# EAGLE design main_low_pass (EAGLE 6.4)
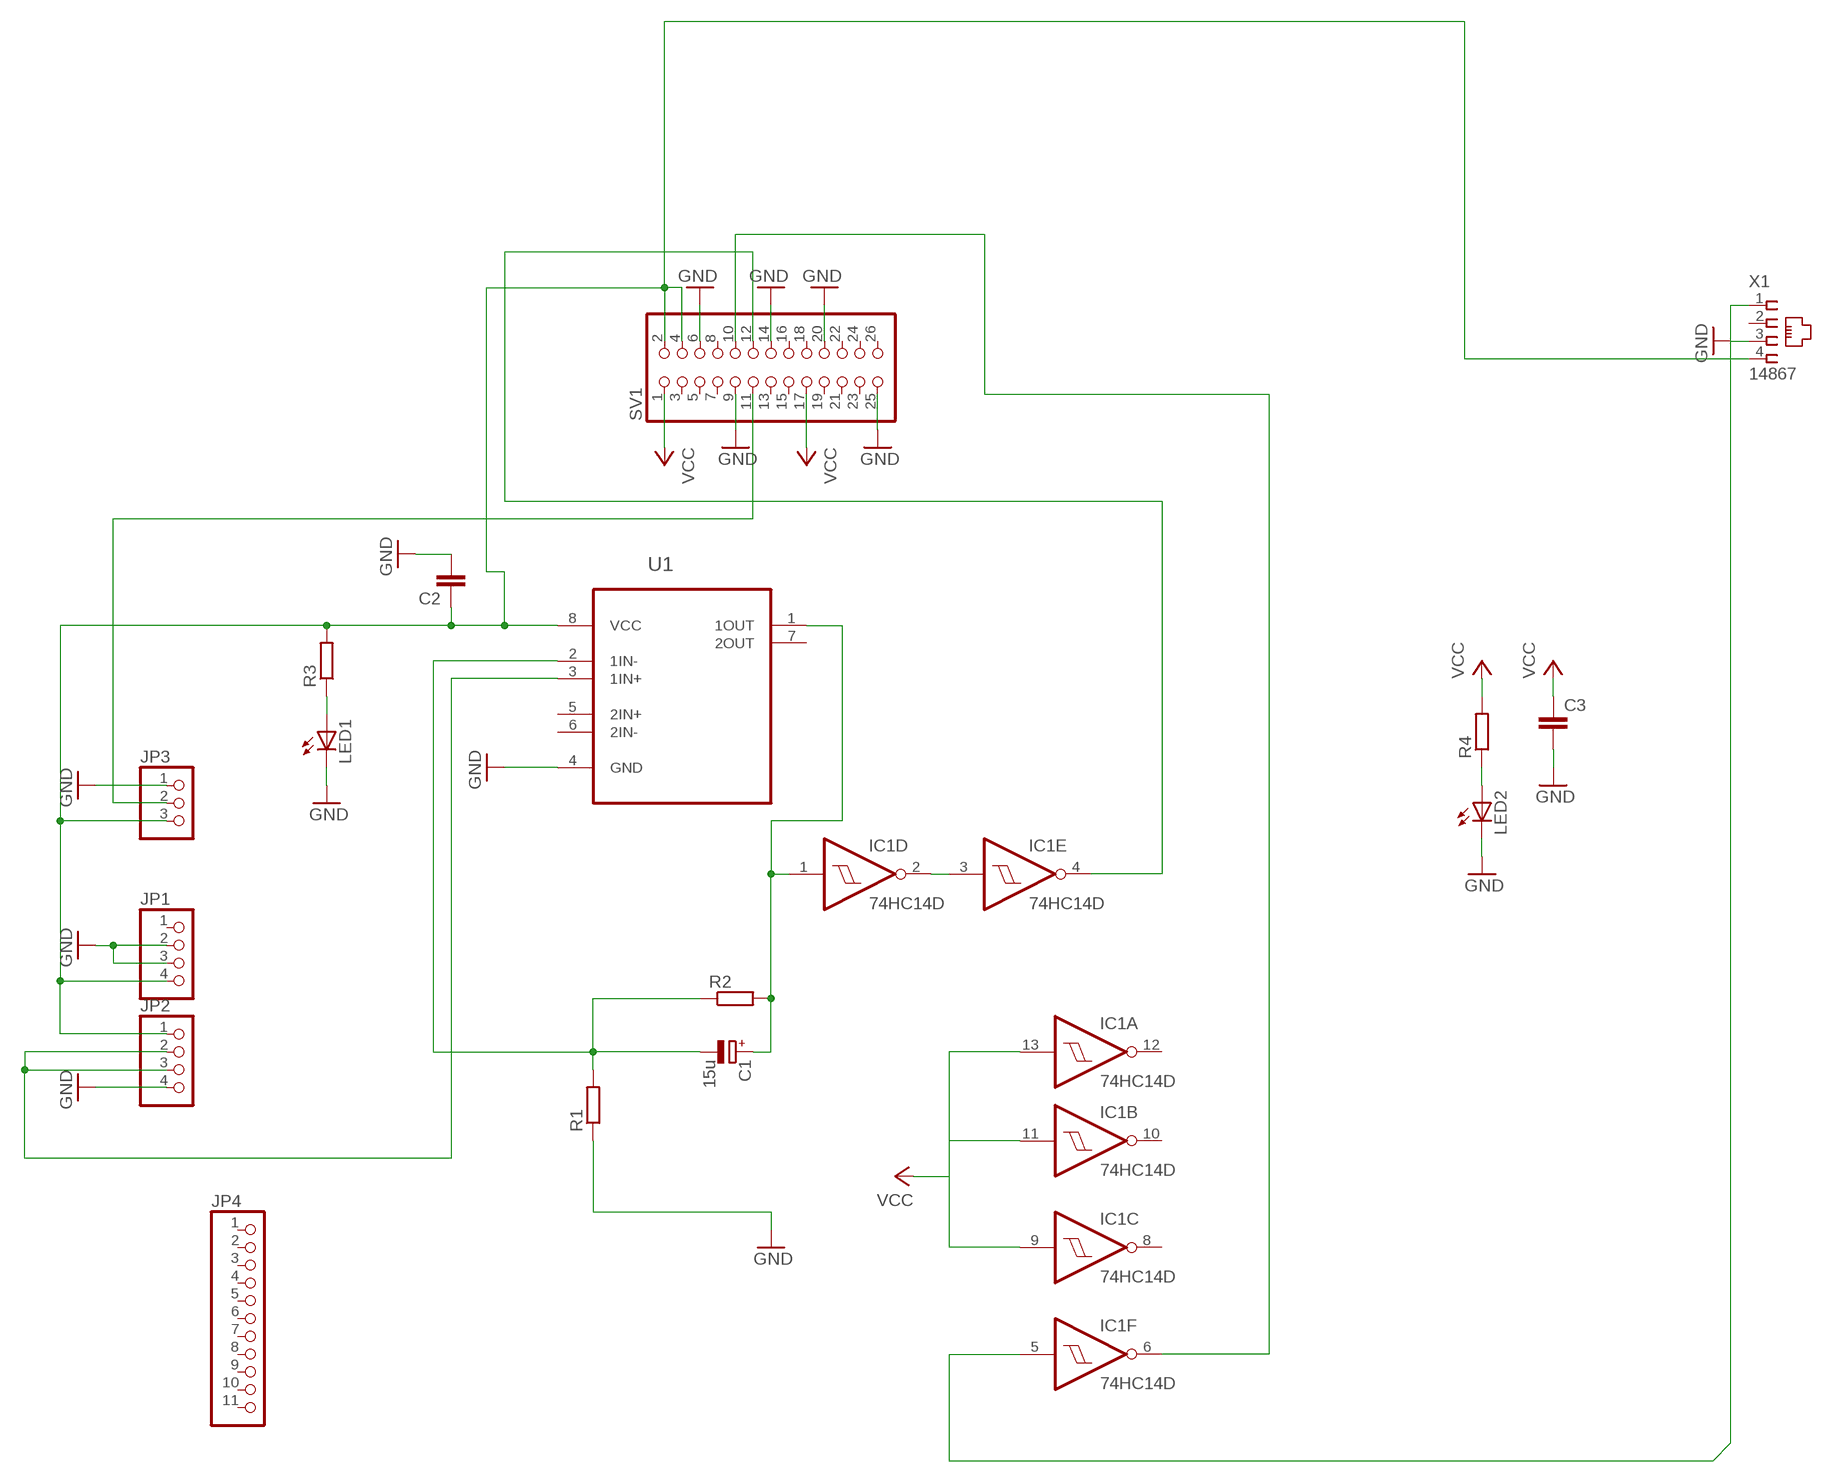
[diagram p0: schematic, sheet 1]

## Parts
C1  15u  CPOL-EU153CLV-0605  [153CLV-0605]
C2  C-EUC0805  [C0805]
C3  C-EUC0805  [C0805]
IC1  74HC14D  [SO14]
JP1  PINHD-1X4  [1X04]
JP2  PINHD-1X4  [1X04]
JP3  PINHD-1X3  [1X03]
JP4  PINHD-1X11  [1X11]
LED1  LEDCHIP-LED0805  [CHIP-LED0805]
LED2  LEDCHIP-LED0805  [CHIP-LED0805]
R1  R-EU_R0805  [R0805]
R2  R-EU_R0805  [R0805]
R3  R-EU_R0805  [R0805]
R4  R-EU_R0805  [R0805]
SV1  PINHD-2X13  [2X13]
U1  LM358PW  [SOP65P640X120-8N]
X1  14867  [14867]

## Nets
GND: C2.2 C3.2 JP1.2 JP1.3 JP2.4 JP3.1 LED1.C LED2.C R1.1 SV1.6 SV1.9 SV1.14 SV1.20 SV1.25 U1.4(GND) X1.3
N$1: JP2.2 JP2.3 U1.3(1IN+)
N$2: C1.- R1.2 R2.1 U1.2(1IN-)
N$3: IC1.2(D:O) IC1.3(E:I)
N$4: IC1.5(F:I) X1.1
N$5: JP3.2 SV1.11
N$6: C2.1 JP1.4 JP2.1 JP3.3 R3.2 SV1.2 SV1.4 U1.8(VCC) X1.4
N$7: C1.+ IC1.1(D:I) R2.2 U1.1(1OUT)
N$8: LED1.A R3.1
N$9: LED2.A R4.1
N$10: IC1.4(E:O) SV1.12
N$11: IC1.6(F:O) SV1.10
VCC: C3.1 IC1.9(C:I) IC1.11(B:I) IC1.13(A:I) R4.2 SV1.1 SV1.17
Unconnected: IC1.8(C:O) IC1.10(B:O) IC1.12(A:O) JP1.1 JP4.1 JP4.2 JP4.3 JP4.4 JP4.5 JP4.6 JP4.7 JP4.8 JP4.9 JP4.10 JP4.11 SV1.3 SV1.5 SV1.7 SV1.8 SV1.13 SV1.15 SV1.16 SV1.18 SV1.19 SV1.21 SV1.22 SV1.23 SV1.24 SV1.26 U1.5(2IN+) U1.6(2IN-) U1.7(2OUT) X1.2

## Power pins joined to a net without a drawn wire
GND: IC1.7(P:GND)
VCC: IC1.14(P:VCC)

## Library data of the parts
C1 = resistor:CPOL-EU: POLARIZED CAPACITOR, European symbol
C2 C3 = resistor:C-EU: CAPACITOR, European symbol
IC1 = 74xx-eu:74*14: Hex schmitt trigger INVERTER
JP1 JP2 = pinhead:PINHD-1X4: PIN HEADER
JP3 = pinhead:PINHD-1X3: PIN HEADER
JP4 = pinhead:PINHD-1X11: PIN HEADER
LED1 LED2 = led:LED: LED OSRAM: - CHIPLED LG R971, LG N971, LY N971, LG Q971, LY Q971, LO R971, LY R971 LH N974, LH R974 LS Q976, LO Q976, LY Q976 LO Q996 - Hyper CHIPLED LW Q18S LB Q993, LB Q99A, LB R99A - SideLED LS A670, LO A670, LY A670, LG A670, LP A670 LB A673, LV A673, LT A673, LW A673 LH A674 LY A675 LS A676, LA A676, LO A676, LY A676, LW A676 LS A679, LY A679, LG A679 - Hyper Micro SIDELED® LS Y876, LA Y876, LO Y876, LY Y876 LT Y87S - SmartLED LW L88C, LW L88S LB L89C, LB L89S, LG L890 LS L89K, LO L89K, LY L89K LS L896, LA L896, LO L896, LY L896 - TOPLED LS T670, LO T670, LY T670, LG T670, LP T670 LSG T670, LSP T670, LSY T670, LOP T670, LYG T670 LG T671, LOG T671, LSG T671 LB T673, LV T673, LT T673, LW T673 LH T674 LS T676, LA T676, LO T676, LY T676, LB T676, LH T676, LSB T676, LW T676 LB T67C, LV T67C, LT T67C, LS T67K, LO T67K, LY T67K, LW E67C LS E67B, LA E67B, LO E67B, LY E67B, LB E67C, LV E67C, LT E67C LW T67C LS T679, LY T679, LG T679 LS T770, LO T770, LY T770, LG T770, LP T770 LB T773, LV T773, LT T773, LW T773 LH T774 LS E675, LA E675, LY E675, LS T675 LS T776, LA T776, LO T776, LY T776, LB T776 LHGB T686 LT T68C, LB T68C - Hyper Mini TOPLED® LB M676 - Mini TOPLED Santana® LG M470 LS M47K, LO M47K, LY M47K Source: http://www.osram.convergy.de LUXEON: - LUMILED® LXK2-PW12-R00, LXK2-PW12-S00, LXK2-PW14-U00, LXK2-PW14-V00 LXK2-PM12-R00, LXK2-PM12-S00, LXK2-PM14-U00 LXK2-PE12-Q00, LXK2-PE12-R00, LXK2-PE12-S00, LXK2-PE14-T00, LXK2-PE14-U00 LXK2-PB12-K00, LXK2-PB12-L00, LXK2-PB12-M00, LXK2-PB14-N00, LXK2-PB14-P00, LXK2-PB14-Q00 LXK2-PR12-L00, LXK2-PR12-M00, LXK2-PR14-Q00, LXK2-PR14-R00 LXK2-PD12-Q00, LXK2-PD12-R00, LXK2-PD12-S00 LXK2-PH12-R00, LXK2-PH12-S00 LXK2-PL12-P00, LXK2-PL12-Q00, LXK2-PL12-R00 Source: www.luxeon.com KINGBRIGHT: KA-3528ASYC Source: www.kingbright.com
R1-R4 = resistor:R-EU_: RESISTOR, European symbol
SV1 = pinhead:PINHD-2X13: PIN HEADER
U1 = untitled:LM358PW: DUAL OPERATIONAL AMPLIFIERS; MPN: LM358PW; OC_FARNELL: 8389250; OC_NEWARK: 38K3721; PACKAGE: TSSOP-8; SUPPLIER: Texas Instruments
X1 = con-4ucon:14867: RJ11 Connector Source: 4UCON TECHNOLOGY INC. 14867.pdf; OC_FARNELL: unknown; OC_NEWARK: unknown

## Board
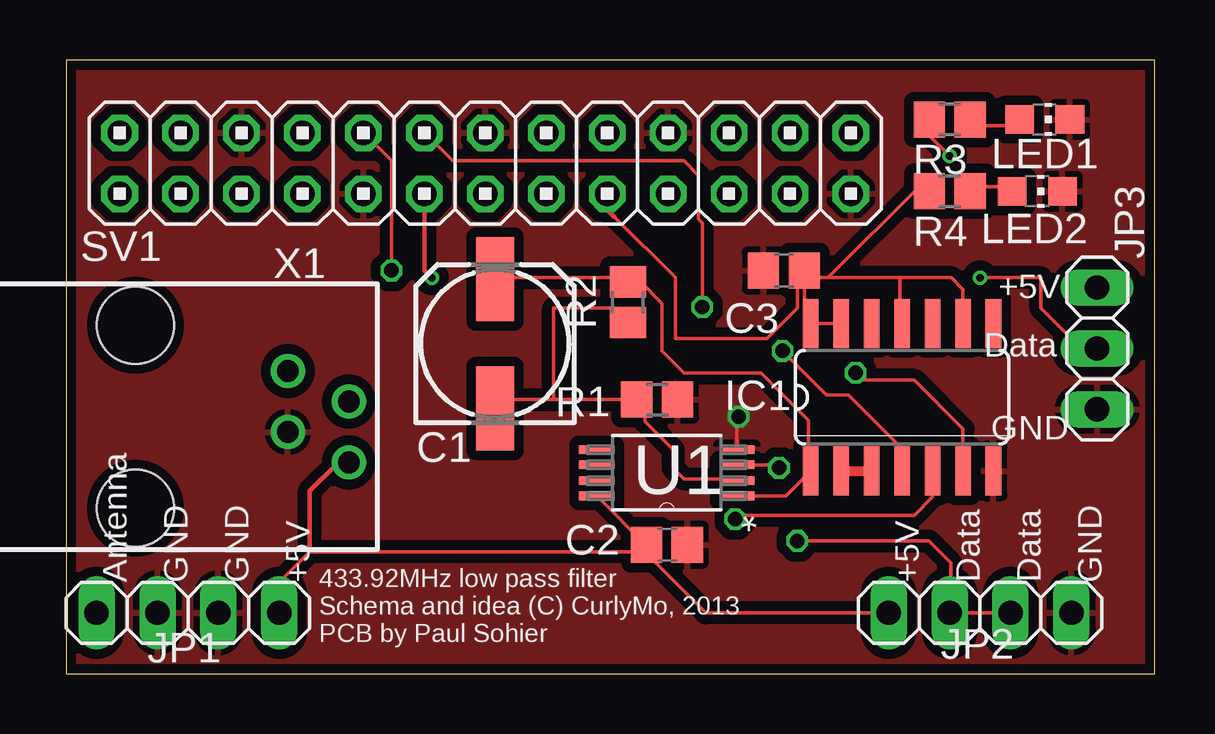
[diagram p1: board, top side]
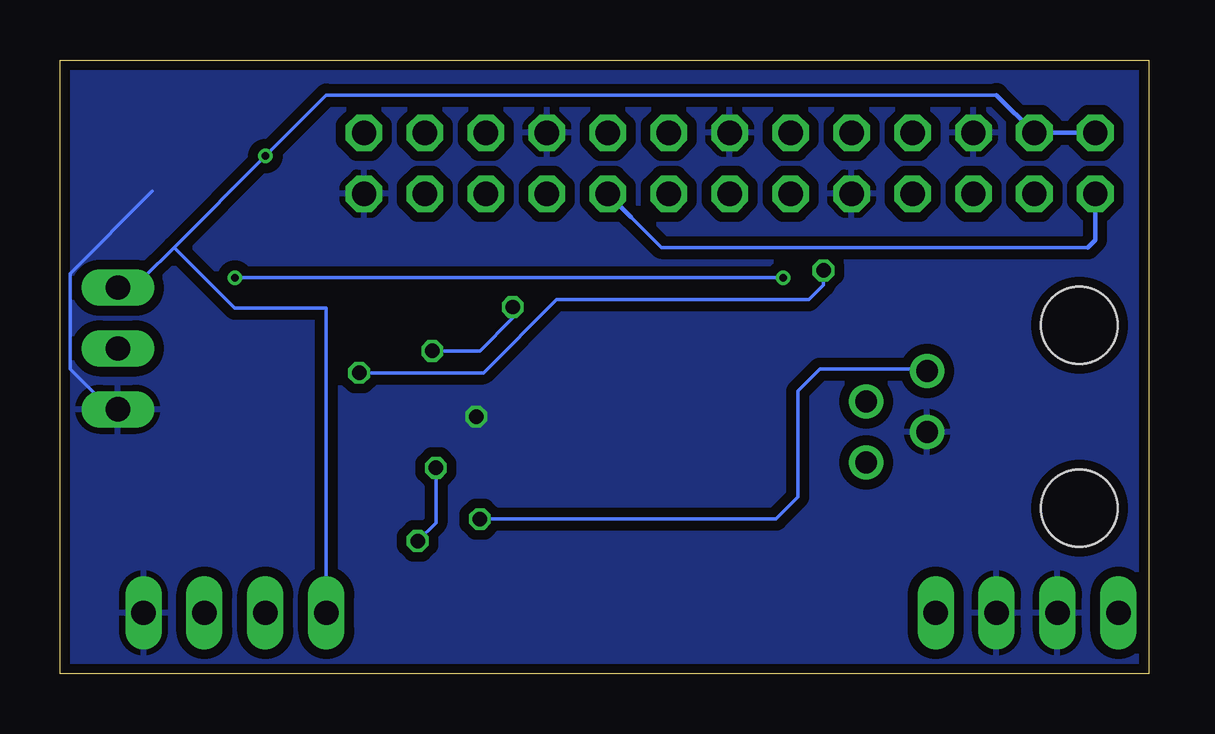
[diagram p2: board, bottom side, seen from below]

Size 45.39 x 25.59 mm. Coordinates in mm from the lower left corner, seen from the top.
Outline: 0,0 45.39,0 45.39,25.59 0,25.59 0,0
Copper layers (1*16): Top 0.035mm / dielectric 1.5mm / Bottom 0.035mm
Design rules "ITEADstudio_DRC": minimum track width 6mil, minimum drill 12mil, track to track 6mil, track to pad 6mil, pad to pad 6mil, via to via 6mil, smd to smd 0mil, copper to edge 10mil, drill to drill 10mil, minimum pad ring 10mil, minimum via ring 6mil, stop-mask expansion 2mil, vias tented up to drill 100mil, thermal gap 10mil

### Footprints (pad centres in the part's own frame; a part is rotated, then mirrored left to right if it is on the bottom)
153CLV-0605 = smd 3.5 x 1.6: + 2.7,0; - -2.7,0
C0805 = smd 1.3 x 1.5: 1 -0.85,0; 2 0.85,0
SO14 = smd 0.66 x 2.032: 1 -3.81,-3.073; 2 -2.54,-3.073; 3 -1.27,-3.073; 4 0,-3.073; 5 1.27,-3.073; 6 2.54,-3.073; 7 3.81,-3.073; 8 3.81,3.073; 9 2.54,3.073; 10 1.27,3.073; 11 0,3.073; 12 -1.27,3.073; 13 -2.54,3.073; 14 -3.81,3.073
1X04 = drill 1.016 long: 1 -3.81,0; 2 -1.27,0; 3 1.27,0; 4 3.81,0
1X03 = drill 1.016 long: 1 -2.54,0; 2 0,0; 3 2.54,0
CHIP-LED0805 = smd 1.2 x 1.2: A 0,-1.05; C 0,1.05
R0805 = smd 1.3 x 1.5: 1 -0.85,0; 2 0.85,0
2X13 = drill 1.016 octagon: 1 -15.24,-1.27; 2 -15.24,1.27; 3 -12.7,-1.27; 4 -12.7,1.27; 5 -10.16,-1.27; 6 -10.16,1.27; 7 -7.62,-1.27; 8 -7.62,1.27; 9 -5.08,-1.27; 10 -5.08,1.27; 11 -2.54,-1.27; 12 -2.54,1.27; 13 0,-1.27; 14 0,1.27; 15 2.54,-1.27; 16 2.54,1.27; 17 5.08,-1.27; 18 5.08,1.27; 19 7.62,-1.27; 20 7.62,1.27; 21 10.16,-1.27; 22 10.16,1.27; 23 12.7,-1.27; 24 12.7,1.27; 25 15.24,-1.27; 26 15.24,1.27
SOP65P640X120-8N = smd 1.473 x 0.356: 1 -2.921,0.965; 2 -2.921,0.33; 3 -2.921,-0.33; 4 -2.921,-0.965; 5 2.921,-0.965; 6 2.921,-0.33; 7 2.921,0.33; 8 2.921,0.965
14867 = drill 0.9 pad 1.422: 1 -1.905,6.35; 2 -0.635,8.89; 3 0.635,6.35; 4 1.905,8.89 | hole 3.2: -3.81,0; 3.81,0

### Placement (x,y rotation side)
C1  17.88,13.77 90 top
C2  25.04,5.38 0 top
C3  29.92,16.81 180 top
IC1  34.85,11.53 0 top
JP1  5.08,2.54 0 top
JP2  38.1,2.54 0 top
JP3  42.98,13.56 90 top
LED1  40.79,23.11 270 top
LED2  40.49,20.12 270 top
R1  24.64,11.43 180 top
R2  23.42,15.49 90 top
R3  36.83,23.11 180 top
R4  36.83,20.12 180 top
SV1  17.48,21.29 0 top
U1  25.04,8.38 180 top
X1  2.9,10.72 270 top

### Tracks (layer width: path | path; a pad name or v marks a point on that pad's centre or on a via)
GND  (via drill 0.6)
  Top 0.152: U1.4 27.96,10.64 v28.04,10.72
  Bottom 0.152: v28.04,10.72 28.04,10.87 27.89,11.02 | JP3.1 43.28,11.02 44.96,12.7 44.96,16.7 LED2.C
  pour Bottom (isolate 0.406): -0.15,25.45 0,0 45.52,0 45.36,25.6
  pour Top (isolate 0.406): 0,0 -0.3,25.45 45.42,25.6 45.72,0
N$1  (via drill 0.6)
  Top 0.152: JP2.3 JP2.2 36.88,2.59 36.88,4.62 35.97,5.54 v30.48,5.54 | U1.3 29.59,8.71 v29.72,8.59
  Bottom 0.152: v29.72,8.59 29.72,6.3 v30.48,5.54
N$2
  Top 0.152: 20.32,11.43 17.78,11.43 C1.- | 20.32,11.43 R1.2 24.13,11.43 24.13,10.52 25.3,9.35 25.3,8.59 25.76,8.13 27.89,8.13 U1.2 | 20.32,11.43 20.32,15.24 22.86,15.24 R2.1
N$3
  Top 0.406: IC1.2 IC1.3
N$4  (via drill 0.6)
  Top 0.152: IC1.5 36.12,7.37 35.36,6.6 28.04,6.6 v27.89,6.45
  Bottom 0.152: v27.89,6.45 15.54,6.45 14.63,7.37 14.63,11.79 13.72,12.7 9.32,12.7 X1.1
N$5  (via drill 0.3)
  Top 0.152: v38.1,16.51 40.64,16.51 40.64,15.24 41.91,13.97 JP3.2
  Top 0.178: v15.24,16.51 14.94,16.82 SV1.11
  Bottom 0.152: v38.1,16.51 v15.24,16.51
N$6  (via drill 0.3)
  Top 0.152: JP1.4 8.89,3.81 10.16,5.08 24.13,5.08 | 24.13,5.08 26.67,2.54 JP2.1 | 24.13,5.08 C2.1 24.16,5.38 U1.8 | v36.83,21.59 35.56,22.86 R3.2
  Top 0.178: 10.16,5.08 10.16,7.62 11.35,8.81 X1.4
  Bottom 0.152: 40.64,17.78 41.91,16.51 JP3.3 | 40.64,17.78 v36.83,21.59 34.29,24.13 6.35,24.13 | JP2.1 34.29,15.24 38.1,15.24 40.64,17.78
  Bottom 0.178: 6.35,24.13 SV1.4 SV1.2
N$7
  Top 0.152: C1.+ 17.78,16.51 22.86,16.51 R2.2 23.94,16.34 24.84,15.44 24.84,13.46 25.76,12.55 28.96,12.55 30.94,10.57 30.94,8.56 IC1.1 30,7.42 U1.1
N$8
  Top 0.152: LED1.A 39.37,22.86 38.1,22.86 R3.1
N$9
  Top 0.152: LED2.A 39.37,20.32 38.1,20.32 R4.1
N$10  (via drill 0.6)
  Top 0.152: IC1.4 34.85,9.4 32.61,11.63 31.7,11.63 v29.87,13.46 | v26.52,15.29 26.52,18.8 26.36,18.95 26.36,20.78 25.76,21.39 16.1,21.39 SV1.12
  Bottom 0.152: v29.87,13.46 27.89,13.46 26.52,14.83 v26.52,15.29
N$11  (via drill 0.6)
  Top 0.152: IC1.6 37.39,10.21 35.36,12.24 33.22,12.24 v32.92,12.55 | v13.56,16.82 13.56,21.39 SV1.10
  Bottom 0.152: v32.92,12.55 27.74,12.55 24.69,15.6 14.17,15.6 13.56,16.21 v13.56,16.82
VCC
  Top 0.152: 31.75,16.51 30.48,16.51 | 31.75,16.51 35.56,20.32 R4.2 | 30.48,16.51 30.48,15.24 29.21,13.97 25.4,13.97 25.4,16.51 22.86,19.05 | 30.48,16.51 C3.1 30.77,14.61 IC1.14 IC1.13 | IC1.9 37.39,16.03 36.91,16.51 34.75,16.51 | 34.75,16.51 31.75,16.51 | IC1.11 34.75,14.71 34.75,16.51
  Top 0.178: 22.86,19.05 22.55,19.36 SV1.17
  Bottom 0.152: 2.54,17.78 20.32,17.78 21.59,19.05
  Bottom 0.178: SV1.1 2.23,18.09 2.54,17.78 | 21.59,19.05 SV1.17

### Text on the board
tPlace: +5V | Data | GND | Antenna | GND | GND | +5V | +5V | Data | Data | GND | 433.92MHz low pass filter / Schema and idea (C) CurlyMo, 2013 / PCB by Paul Sohier